# Altium schematic sheet 03 - MCU.SchDoc
size A4; SheetNumber: 2; SheetTotal: 4; SchemaTitle: Overview
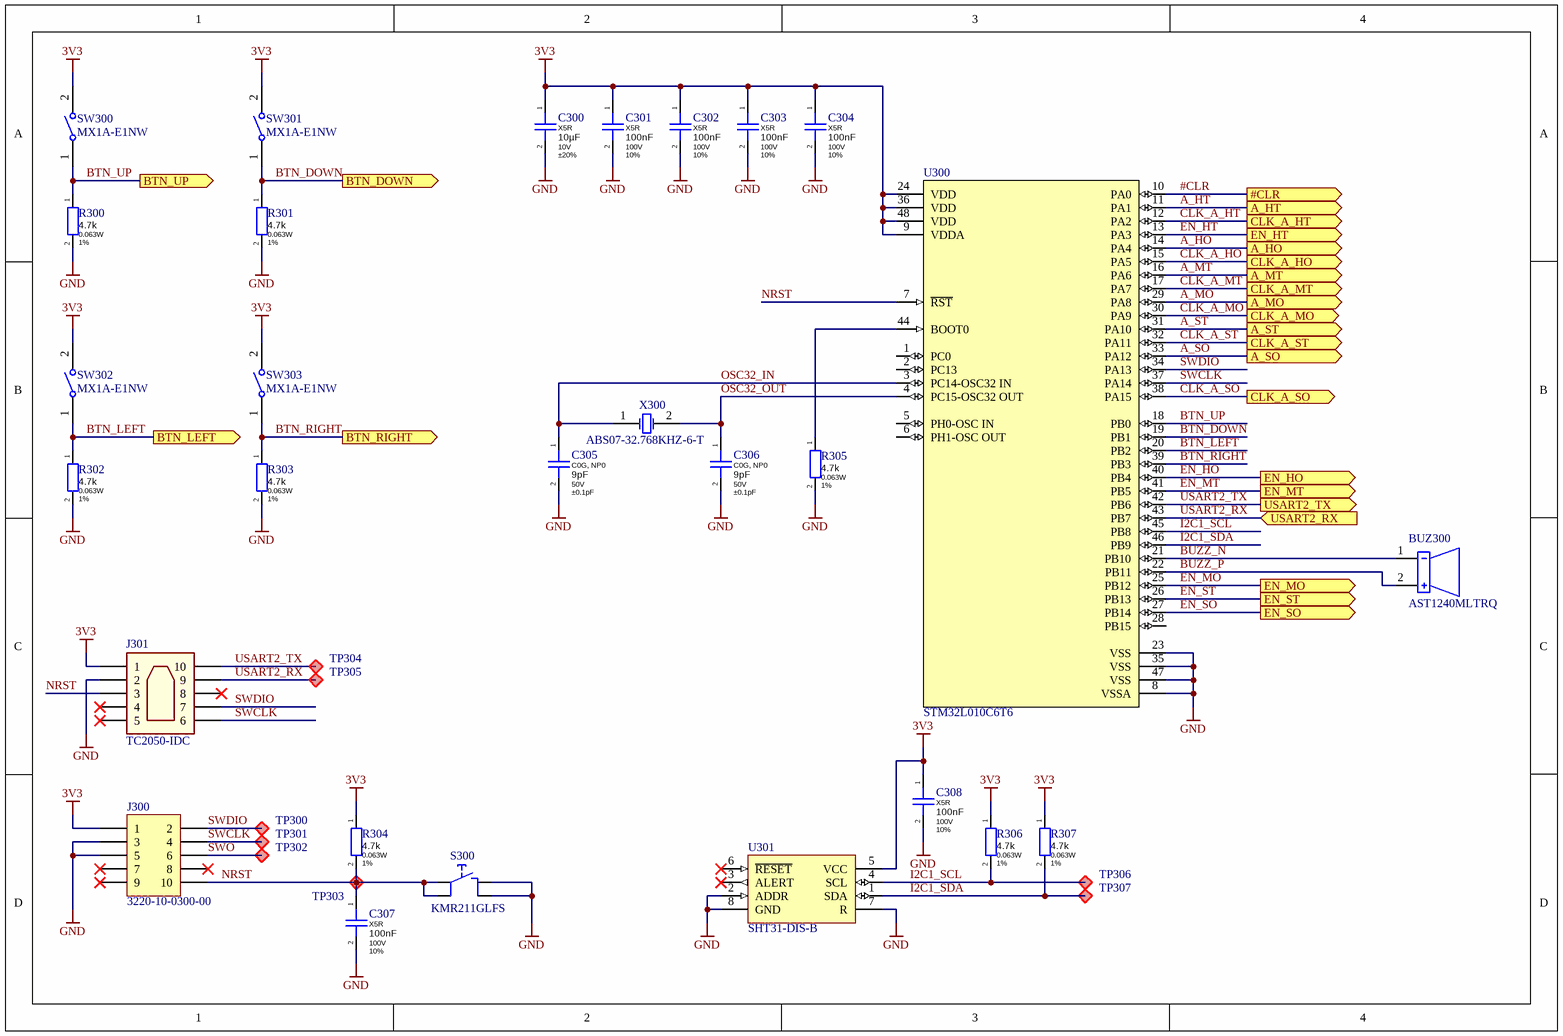
[diagram p0: 03 - MCU.SchDoc]

## Parts
BUZ300  AST1240MLTRQ  [AST1240MLTRQ]
C300  Dielectric: X5R  Capacitance: 10µF  Voltage Rating: 10V  Tolerance: ±20%  [CAPC0402(1005)60_L]  (hidden comment: CL05A106MP8NUB8)
C301  Dielectric: X5R  Capacitance: 100nF  Voltage Rating: 100V  Tolerance: 10%  [CAPC0402(1005)60_L]  (hidden comment: GRM155R62A104KE14D)
C302  Dielectric: X5R  Capacitance: 100nF  Voltage Rating: 100V  Tolerance: 10%  [CAPC0402(1005)60_L]  (hidden comment: GRM155R62A104KE14D)
C303  Dielectric: X5R  Capacitance: 100nF  Voltage Rating: 100V  Tolerance: 10%  [CAPC0402(1005)60_L]  (hidden comment: GRM155R62A104KE14D)
C304  Dielectric: X5R  Capacitance: 100nF  Voltage Rating: 100V  Tolerance: 10%  [CAPC0402(1005)60_L]  (hidden comment: GRM155R62A104KE14D)
C305  Dielectric: C0G, NP0  Capacitance: 9pF  Voltage Rating: 50V  Tolerance: ±0.1pF  [CAPC0402(1005)60_L]  (hidden comment: CC0402BRNPO9BN9R0)
C306  Dielectric: C0G, NP0  Capacitance: 9pF  Voltage Rating: 50V  Tolerance: ±0.1pF  [CAPC0402(1005)60_L]  (hidden comment: CC0402BRNPO9BN9R0)
C307  Dielectric: X5R  Capacitance: 100nF  Voltage Rating: 100V  Tolerance: 10%  [CAPC0402(1005)60_L]  (hidden comment: GRM155R62A104KE14D)
C308  Dielectric: X5R  Capacitance: 100nF  Voltage Rating: 100V  Tolerance: 10%  [CAPC0402(1005)60_L]  (hidden comment: GRM155R62A104KE14D)
J300  3220-10-0300-00  [3220-10-0300-00-Footprint-1]
J301  TC2050-IDC  [TC2050-IDC]  (no BOM)
R300  Resistance: 4.7k  Power Rating: 0.063W  Tolerance: 1%  [RESC0402(1005)_L]  (hidden comment: RMCF0402FT4K70)
R301  Resistance: 4.7k  Power Rating: 0.063W  Tolerance: 1%  [RESC0402(1005)_L]  (hidden comment: RMCF0402FT4K70)
R302  Resistance: 4.7k  Power Rating: 0.063W  Tolerance: 1%  [RESC0402(1005)_L]  (hidden comment: RMCF0402FT4K70)
R303  Resistance: 4.7k  Power Rating: 0.063W  Tolerance: 1%  [RESC0402(1005)_L]  (hidden comment: RMCF0402FT4K70)
R304  Resistance: 4.7k  Power Rating: 0.063W  Tolerance: 1%  [RESC0402(1005)_L]  (hidden comment: RMCF0402FT4K70)
R305  Resistance: 4.7k  Power Rating: 0.063W  Tolerance: 1%  [RESC0402(1005)_L]  (hidden comment: RMCF0402FT4K70)
R306  Resistance: 4.7k  Power Rating: 0.063W  Tolerance: 1%  [RESC0402(1005)_L]  (hidden comment: RMCF0402FT4K70)
R307  Resistance: 4.7k  Power Rating: 0.063W  Tolerance: 1%  [RESC0402(1005)_L]  (hidden comment: RMCF0402FT4K70)
S300  KMR211GLFS  [KMR211GLFS]
SW300  MX1A-E1NW  [MX1A-E1NW-Footprint-1]
SW301  MX1A-E1NW  [MX1A-E1NW-Footprint-1]
SW302  MX1A-E1NW  [MX1A-E1NW-Footprint-1]
SW303  MX1A-E1NW  [MX1A-E1NW-Footprint-1]
TP300  Testpoint  [Testpoint SMD 1.5mm]  (value not drawn)  (no BOM)
TP301  Testpoint  [Testpoint SMD 1.5mm]  (value not drawn)  (no BOM)
TP302  Testpoint  [Testpoint SMD 1.5mm]  (value not drawn)  (no BOM)
TP303  Testpoint  [Testpoint SMD 1.5mm]  (value not drawn)  (no BOM)
TP304  Testpoint  [Testpoint SMD 1.5mm]  (value not drawn)  (no BOM)
TP305  Testpoint  [Testpoint SMD 1.5mm]  (value not drawn)  (no BOM)
TP306  Testpoint  [Testpoint SMD 1.5mm]  (value not drawn)  (no BOM)
TP307  Testpoint  [Testpoint SMD 1.5mm]  (value not drawn)  (no BOM)
U300  STM32L010C6T6  [LQFP-48 (LQ)]
U301  SHT31-DIS-B  [8  -  Pin DFN 2.5  x  2.5  mm x 0.9 mm]
X300  ABS07-32.768KHZ-6-T  [ABRA-ABS07_V]

## Ports
#CLR (out), A_HO (out), A_HT (out), A_MO (out), A_MT (out), A_SO (out), A_ST (out), BTN_DOWN (out), BTN_LEFT (out), BTN_RIGHT (out), BTN_UP (out), CLK_A_HO (out), CLK_A_HT (out), CLK_A_MO (out), CLK_A_MT (out), CLK_A_SO (out), CLK_A_ST (out), EN_HO (out), EN_HT (out), EN_MO (out), EN_MT (out), EN_SO (out), EN_ST (out), USART2_RX (in), USART2_TX (out)

## Nets
3V3: C300.1 C301.1 C302.1 C303.1 C304.1 C308.1 J300.1 J301.1 R304.1 R306.1 R307.1 SW300.2 SW301.2 SW302.2 SW303.2 U300.9(VDDA) U300.24(VDD) U300.36(VDD) U300.48(VDD) U301.5(VCC)
GND: C300.2 C301.2 C302.2 C303.2 C304.2 C305.2 C306.2 C307.2 C308.2 J300.3 J300.5 J301.2 R300.2 R301.2 R302.2 R303.2 R305.2 S300.3 S300.4 U300.8(VSSA) U300.23(VSS) U300.35(VSS) U300.47(VSS) U301.2(ADDR) U301.7(R) U301.8(GND)
#CLR: U300.10(PA0) ; port #CLR
A_HO: U300.14(PA4) ; port A_HO
A_HT: U300.11(PA1) ; port A_HT
A_MO: U300.29(PA8) ; port A_MO
A_MT: U300.16(PA6) ; port A_MT
A_SO: U300.33(PA12) ; port A_SO
A_ST: U300.31(PA10) ; port A_ST
BTN_DOWN: R301.1 SW301.1 U300.19(PB1) ; port BTN_DOWN
BTN_LEFT: R302.1 SW302.1 U300.20(PB2) ; port BTN_LEFT
BTN_RIGHT: R303.1 SW303.1 U300.39(PB3) ; port BTN_RIGHT
BTN_UP: R300.1 SW300.1 U300.18(PB0) ; port BTN_UP
BUZZ_N: BUZ300.1(DAT3) U300.21(PB10)
BUZZ_P: BUZ300.2(DAT2) U300.22(PB11)
CLK_A_HO: U300.15(PA5) ; port CLK_A_HO
CLK_A_HT: U300.12(PA2) ; port CLK_A_HT
CLK_A_MO: U300.30(PA9) ; port CLK_A_MO
CLK_A_MT: U300.17(PA7) ; port CLK_A_MT
CLK_A_SO: U300.38(PA15) ; port CLK_A_SO
CLK_A_ST: U300.32(PA11) ; port CLK_A_ST
EN_HO: U300.40(PB4) ; port EN_HO
EN_HT: U300.13(PA3) ; port EN_HT
EN_MO: U300.25(PB12) ; port EN_MO
EN_MT: U300.41(PB5) ; port EN_MT
EN_SO: U300.27(PB14) ; port EN_SO
EN_ST: U300.26(PB13) ; port EN_ST
I2C1_SCL: R306.2 TP306.1 U300.45(PB8) U301.4(SCL)
I2C1_SDA: R307.2 TP307.1 U300.46(PB9) U301.1(SDA)
NRST: C307.1 J300.10 J301.3 R304.2 S300.1 S300.2 TP303.1 U300.7(~{RST})
OSC32_IN: C305.1 U300.3(PC14-OSC32_IN) X300.1(X1)
OSC32_OUT: C306.1 U300.4(PC15-OSC32_OUT) X300.2(X2)
SWCLK: J300.4 J301.6 TP301.1 U300.37(PA14)
SWDIO: J300.2 J301.7 TP300.1 U300.34(PA13)
SWO: J300.6 TP302.1
USART2_RX: J301.9 TP305.1 U300.43(PB7) ; port USART2_RX
USART2_TX: J301.10 TP304.1 U300.42(PB6) ; port USART2_TX
NetR305_1: R305.1 U300.44(BOOT0)

Not connected (* = marked no-connect by the designer): J300 7* 8* 9*; J301 4* 5* 8*; U300 1(PC0) 2(PC13) 5(PH0-OSC_IN) 6(PH1-OSC_OUT) 28(PB15); U301 3(ALERT)* 6(~{RESET})*

## Notes on the sheet
- Schema Title:
- Project:
- Revision:
- Author:
- PCB Name:
- Date:
- Time:
- Sheet:
- of
- Doc Name:
- A4

## Library data of the parts
BUZ300 = CMP-00050-02: Buzzers Transducer, Externally Driven Piezo 3V 5mA 4kHz 75dB @ 3V, 10cm Surface Mount Solder Pads; Manufacturer: Mallory Sonalert Products Inc.; Max Supply Voltage: 25V; Min Supply Voltage: 1V; REACH SVHC: Unknown; Supplier Part Number 1: 458-1094-1-ND; Width: 12mm; Manufacturer Part Number: AST1240MLTRQ; Frequency: 4kHz; Termination: Solder; Packaging: Tape and Reel; Supplier 1: DigiKey; Max Operating Temperature: 70°C; Case/Package: SMD/SMT; Color: Black; Self Resonant Frequency: 4kHz; Mount: Surface Mount; Min Operating Temperature: -20°C; ComponentLink1Description: Datasheet; Height: 3.3mm; ComponentLink1URL: https://www.mspindy.com/specifications/AST1240MLTRQ.pdf; Length: 12mm; Current Rating: 5mA; Operating Supply Current: 5mA; Voltage Rating: 3V
C300 = CMP-00826-01: 10µF ±20% 10V Ceramic Capacitor X5R 0402 (1005 Metric); Manufacturer: Samsung Electro-Mechanics; Supplier 1: Digi-Key; ComponentLink1Description: Datasheet; Supplier Part Number 1: 1276-6830-1-ND; Manufacturer Part Number: CL05A106MP8NUB8
C301-C304 C307 C308 = CMP-00636-01: 0.1µF ±10% 100V Ceramic Capacitor X5R 0402 (1005 Metric); Manufacturer: Murata Electronics; RoHS Compliant: Yes; Mount: Surface Mount; Max Operating Temperature: 85°C; Min Operating Temperature: -55°C; Supplier Part Number 1: 490-10458-1-ND; Case/Package: 0402; Length: 0.039inch; Manufacturer Part Number: GRM155R62A104KE14D; Termination: SMD/SMT; Thickness: 0.022inch; ComponentLink1Description: Datasheet; Packaging: Tape and Reel; Height: 0.5mm; Package Quantity: 10000; Supplier 1: Digi-Key; Case Code (Imperial): 0402; Lead Free: Lead Free; Case Code (Metric): 1005; Voltage Rating (DC): 100V; Width: 0.5mm; Weight: 0.000212oz; REACH SVHC: No SVHC
C305 C306 = CMP-00880-01: 9pF ±0.1pF 50V Ceramic Capacitor C0G, NP0 0402 (1005 Metric); Manufacturer: Yageo; ComponentLink1Description: Datasheet; ComponentLink1URL: https://www.yageo.com/upload/media/product/productsearch/datasheet/mlcc/UPY-GP_NP0_16V-to-50V_18.pdf; Supplier 1: Digi-Key; Manufacturer Part Number: CC0402BRNPO9BN9R0; Datasheet: https://www.yageo.com/upload/media/product/productsearch/datasheet/mlcc/UPY-GP_NP0_16V-to-50V_18.pdf; Supplier Part Number 1: 311-1629-1-ND
J300 = CMP-01468-03: Connector Header Surface Mount 10 position 0.050" (1.27mm); Manufacturer: CNC Tech; ComponentLink1Description: Datasheet; Datasheet: https://www.cnctech.us/pdfs/3220-XX-0300-00_.pdf; Supplier Part Number 1: 1175-1629-ND; Supplier 1: Digi-Key; Manufacturer Part Number: 3220-10-0300-00; ComponentLink1URL: https://www.cnctech.us/pdfs/3220-XX-0300-00_.pdf
J301 = TDC2050-IDC-06: TDC2050-IDC, 10Pins, dual footprint (leg and no-legs); Manufacturer: Tag-Connect; Manufacturer Part Number: TC2050-IDC; Supplier Part Number 1: TC2050-IDC; ComponentLink1Description: Datasheet; SchLibComponentName: TC2050-IDC; Supplier 1: Tag-Connect; ComponentLink1URL: http://www.tag-connect.com/Materials/TC2050-IDC%20Datasheet.pdf
R300-R307 = CMP-00490-01: 4.7 kOhms ±1% 0.063W, 1/16W Chip Resistor 0402 (1005 Metric) Automotive AEC-Q200 Thick Film; Manufacturer: Stackpole Electronics Inc; Max Power Dissipation: 63mW; Temperature Coefficient: 100ppm/°C; Case Code (Metric): 1005; Case Code (Imperial): 0402; Min Operating Temperature: -55°C; Supplier Part Number 1: RMCF0402FT4K70CT-ND; Radiation Hardening: No; Width: 0.02inch; Depth: 0.5mm; Supplier 1: Digi-Key; Case/Package: 0402; Length: 1mm; Lead Free: Lead Free; Height: 0.016inch; Max Operating Temperature: 155°C; Features: Automotive AEC-Q200; Number of Terminations: 2; Resistor Type: Thick Film; Contact Plating: Tin,Matte; Military Standard: Not; Manufacturer Part Number: RMCF0402FT4K70; Mount: Surface Mount; Packaging: Tape and Reel; ComponentLink1Description: Datasheet
S300 = KMR211GLFS-02: SWITCH TACTILE SPST-NO 0.05A 32V; Manufacturer: C&K Components; Actuator Orientation: Top Actuated; Outline: 4.60mm x 2.80mm; Contact Rating @ Voltage: 0.05A @ 32VDC; Actuator Type: Standard; Operating Force: 120gf; Switch Function: Off-Mom; Illumination: Non-Illuminated; Actuator Height off PCB, from Pins: 1.90mm; Switch Travel: 0.20mm; Mechanical Life: 200,000 Cycles; Manufacturer Part Number: KMR211GLFS; ComponentLink1Description: Datasheet; Supplier Part Number 1: 401-1426-1-ND; Mounting Type: Surface Mount; Circuit: SPST-NO; Termination Style: Gull Wing; Illumination Type, Color: -; RoHS: RoHS Compliant; Stock 1: 31963; Category: Switches; Actuator Material: -; Supplier 1: Digi-Key; Illumination Voltage (Nominal): -; Ingress Protection: -; Operating Temperature: -40°C ~ 85°C; SchLibComponentName: KMR211GLFS; Features: Grounding Pin; ComponentLink1URL: kmr2 (pdf, 134.614 KB); Pricing 1: 1=0.51, 10=0.493, 25=0.484, 50=0.4656, 100=0.4017, 250=0.3652, 500=0.34694, 1000=0.2739 (USD); Packaging: Cut Tape (CT)
SW300-SW303 = CMP-02020-04: Pushbutton Switch SPST-NO Keyswitch Through Hole; Manufacturer: Cherry Americas LLC; Manufacturer Part Number: MX1A-E1NW; Supplier 1: Digi-Key; ComponentLink1URL: https://www.mouser.ch/datasheet/2/71/EN_CHERRY_MX_BLUE-1608304.pdf; Supplier Part Number 1: CH197-ND; ComponentLink1Description: Datasheet
TP300-TP307 = CMP-00246-13: Testpoint various footprints
U300 = CMP-02019-01: RISC Microcontroller, 32-Bit, FLASH, CORTEX-M0 CPU, 32MHz; Manufacturer: STMicroelectronics; Supplier 1: Digi-Key; Manufacturer Part Number: STM32L010C6T6; ComponentLink1Description: Datasheet; Supplier Part Number 1: 497-19662-ND; ComponentLink1URL: https://www.st.com/resource/en/datasheet/stm32l010c6.pdf
U301 = CMP-00089-07: SENSIRION         SHT31-DIS-B             Humidity Sensor, 2 %, 3.3 V, 0% to 100% Relative Humidity, TDFN, 8 Pins, 8 s; Accuracy: 2%; Sensor Type: Temperature; Interface: I2C; Response Time: 8s; Min Supply Voltage: 2.4V; Operating Supply Voltage: 3.3V; Max Supply Voltage: 5.5V; Output Type: I2C, Digital; Packaging: Cut Tape; Height: 1mm; ComponentLink1Description: Datasheet; Case/Package: DFN; Number of Pins: 8; Min Operating Temperature: -40°C; Supplier 1: Digi-Key; ComponentLink1URL: https://sensirion.com/media/documents/213E6A3B/63A5A569/Datasheet_SHT3x_DIS.pdf; Manufacturer Part Number: SHT31-DIS-B; Supplier Part Number 1: 1649-1011-1-ND; REACH SVHC: No SVHC; Mount: Surface Mount; Datasheet: https://sensirion.com/media/documents/213E6A3B/63A5A569/Datasheet_SHT3x_DIS.pdf; Manufacturer: Sensirion; Width: 2.6mm; Length: 2.6mm; Max Operating Temperature: 125°C; Lead Free: Lead Free
X300 = CMP-00729-01: 32.768kHz ±20ppm Crystal 6pF 70 kOhms 2-SMD, No Lead; Manufacturer: Abracon LLC; Manufacturer Part Number: ABS07-32.768KHZ-6-T; Supplier Part Number 1: 535-11898-1-ND; Supplier 1: Digi-Key; ComponentLink1Description: Datasheet